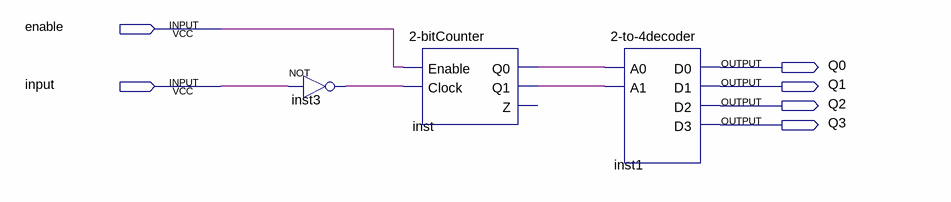
[diagram p0: schematic sheet]
// Quartus schematic router.bdf as structural Verilog: 3 symbols, 6 pins
module router (
  input  enable,
  input  \input ,
  output Q0,
  output Q1,
  output Q2,
  output Q3
);

  wire inst3_out, inst_q0, inst_q1;

  not inst3 (inst3_out, \input );
  \2-bitCounter  inst (.Enable(enable), .Clock(inst3_out), .Q0(inst_q0), .Q1(inst_q1));  // open: Z
  \2-to-4decoder  inst1 (.A0(inst_q0), .A1(inst_q1), .D0(Q0), .D1(Q1), .D2(Q2), .D3(Q3));
endmodule
